# Altium schematic sheet OLED.SchDoc
size A4
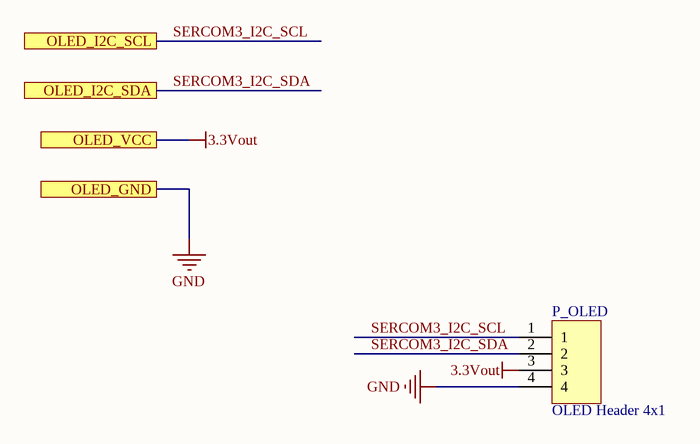
[diagram p0: OLED.SchDoc]

## Parts
P_OLED  OLED Header 4x1  [Header 4x1]

## Ports
OLED_GND, OLED_I2C_SCL, OLED_I2C_SDA, OLED_VCC

## Nets
3.3Vout: P_OLED.3 ; port OLED_VCC
GND: P_OLED.4 ; port OLED_GND
SERCOM3_I2C_SCL: P_OLED.1 ; port OLED_I2C_SCL
SERCOM3_I2C_SDA: P_OLED.2 ; port OLED_I2C_SDA

## Library data of the parts
P_OLED = Header 4x1 OLED: Referred to the Miscellenous Connectors.IntLib Head 4.